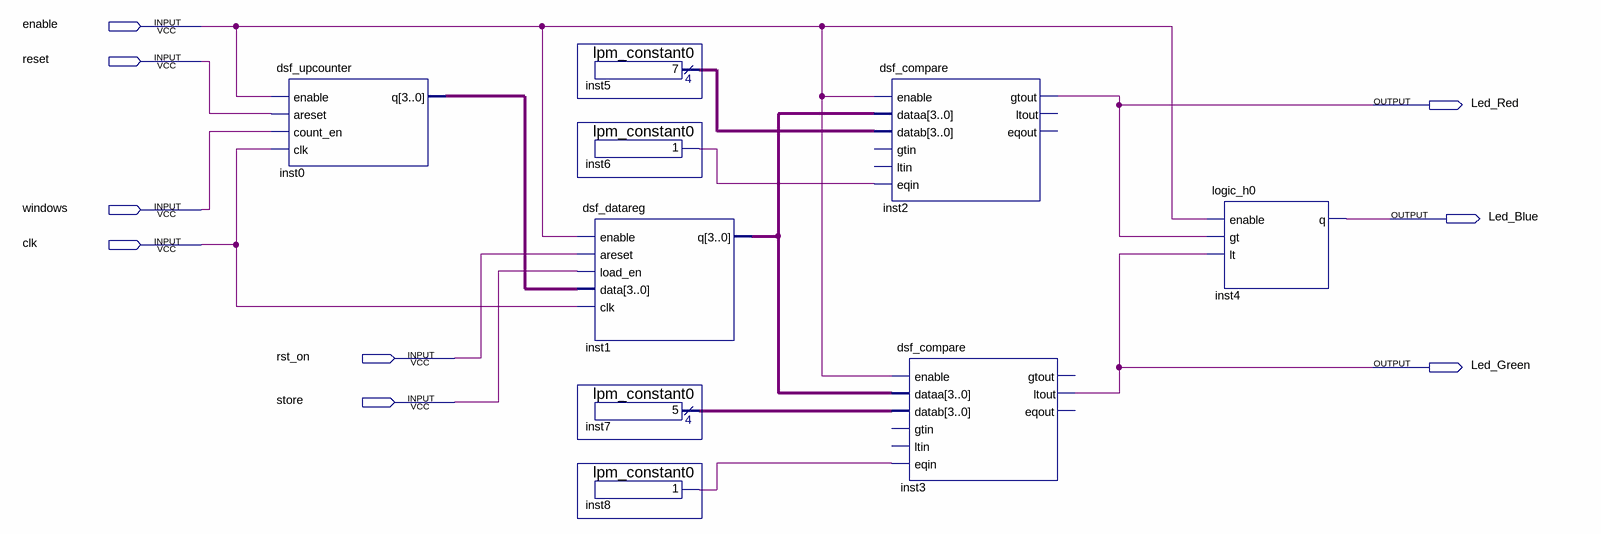
[diagram p0: schematic sheet]
// Quartus schematic Esquematico_Logic_h0.bdf as structural Verilog: 9 symbols, 9 pins
module Esquematico_Logic_h0 (
  input  enable,
  input  reset,
  input  windows,
  input  clk,
  input  rst_on,
  input  store,
  output Led_Red,
  output Led_Blue,
  output Led_Green
);

  wire inst6_result, inst8_result;
  wire [3:0] inst0_q, inst1_q, inst5_result, inst7_result;

  dsf_upcounter inst0 (.enable(enable), .areset(reset), .count_en(windows), .clk(clk), .q(inst0_q));
  lpm_constant0 inst5 (.result(inst5_result));
  lpm_constant0 inst6 (.result(inst6_result));
  dsf_datareg inst1 (.enable(enable), .areset(rst_on), .load_en(store), .clk(clk), .data(inst0_q), .q(inst1_q));
  lpm_constant0 inst7 (.result(inst7_result));
  lpm_constant0 inst8 (.result(inst8_result));
  dsf_compare inst2 (
    .enable(enable), .dataa(inst1_q), .datab(inst5_result), .eqin(inst6_result), .gtout(Led_Red));  // open: gtin, ltin, ltout, eqout
  dsf_compare inst3 (
    .enable(enable), .dataa(inst1_q), .datab(inst7_result), .eqin(inst8_result), .ltout(Led_Green));  // open: gtin, ltin, gtout, eqout
  logic_h0 inst4 (.enable(enable), .gt(Led_Red), .lt(Led_Green), .q(Led_Blue));
endmodule
